# Altium schematic sheet Leningrad_orig.SchDoc
size A1
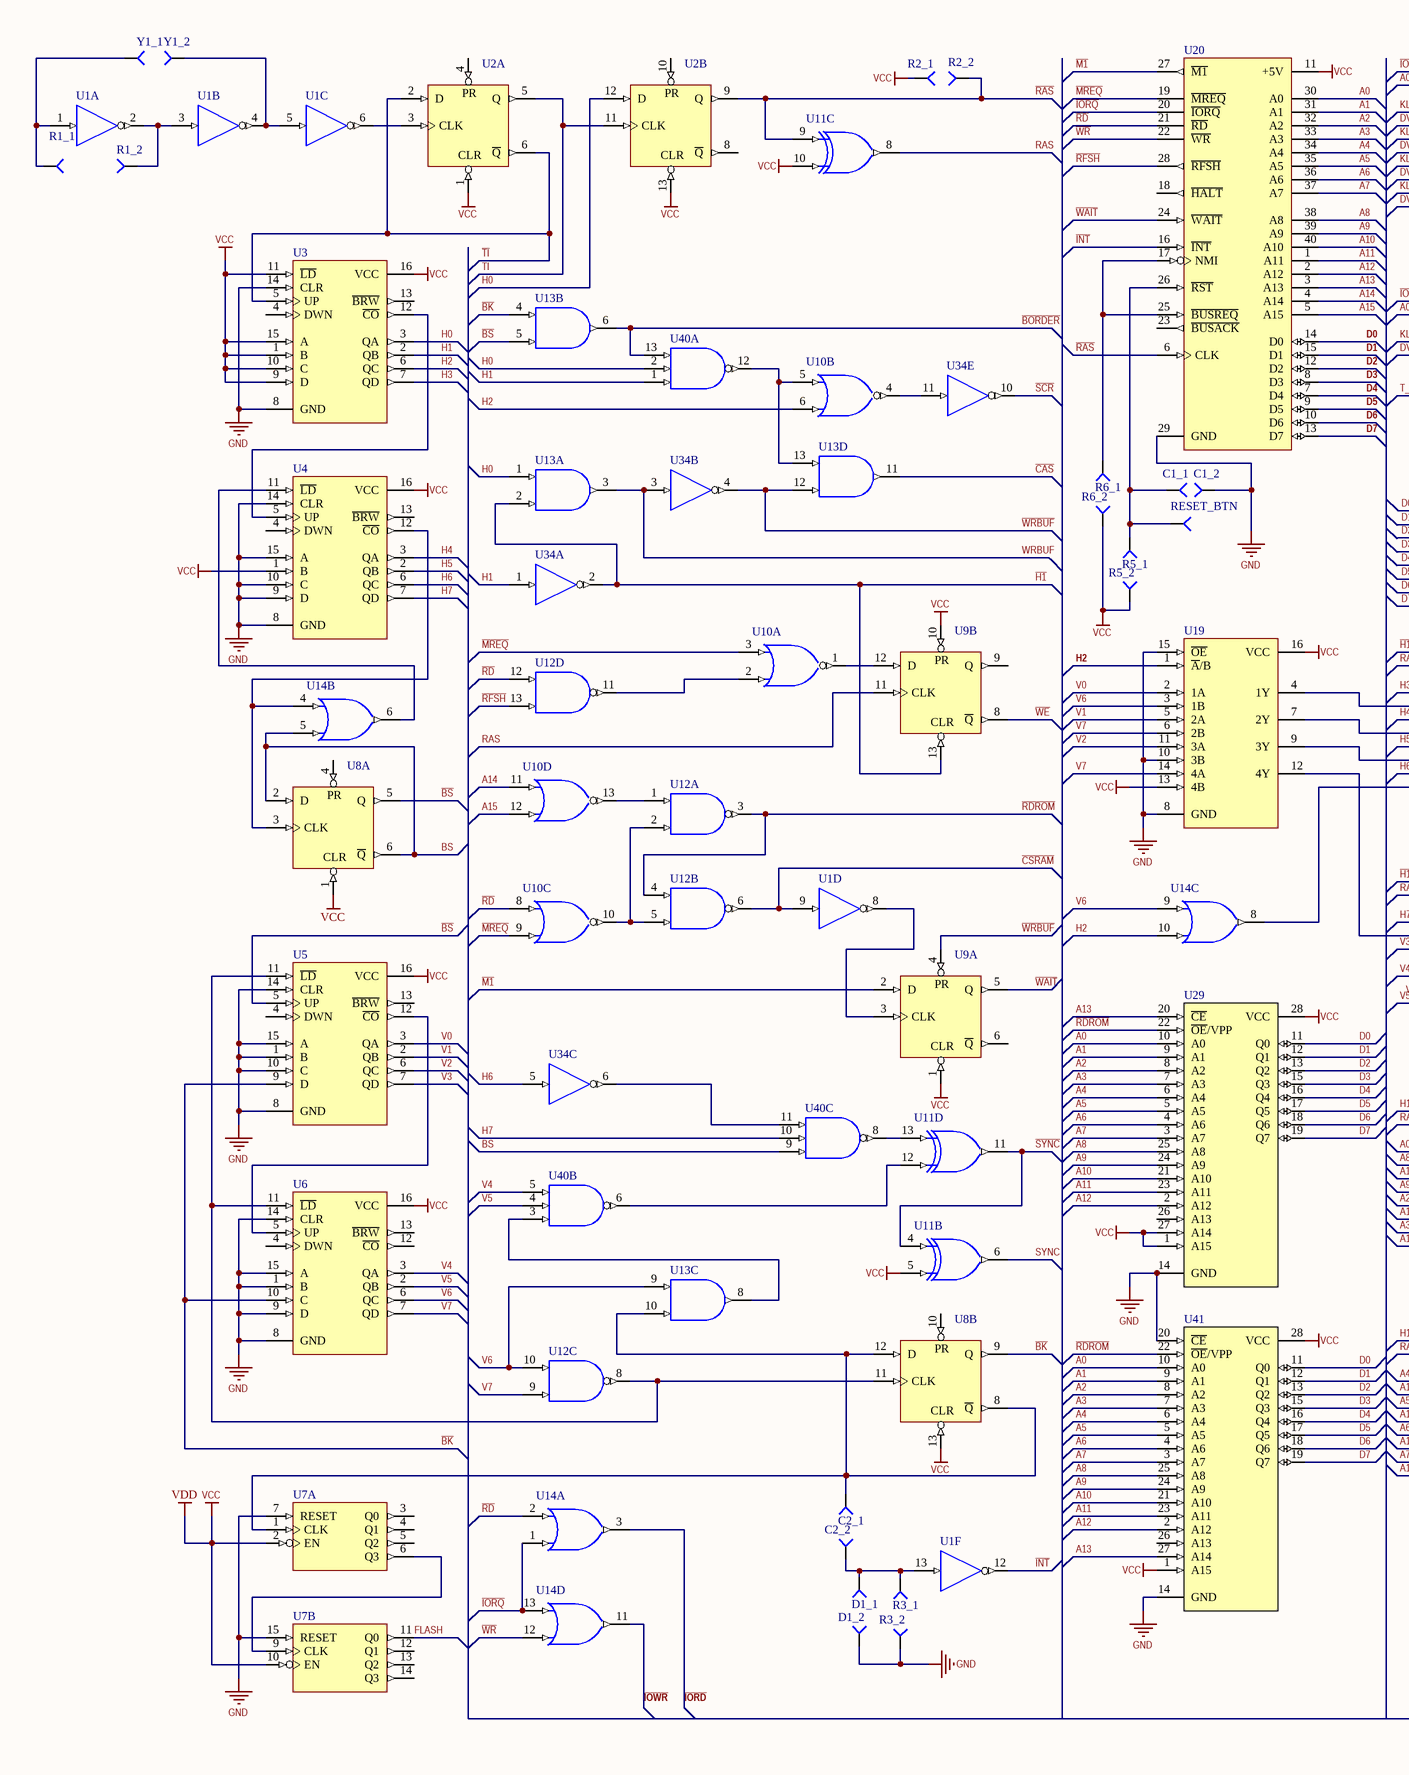
[diagram p0: Leningrad_orig.SchDoc, left]
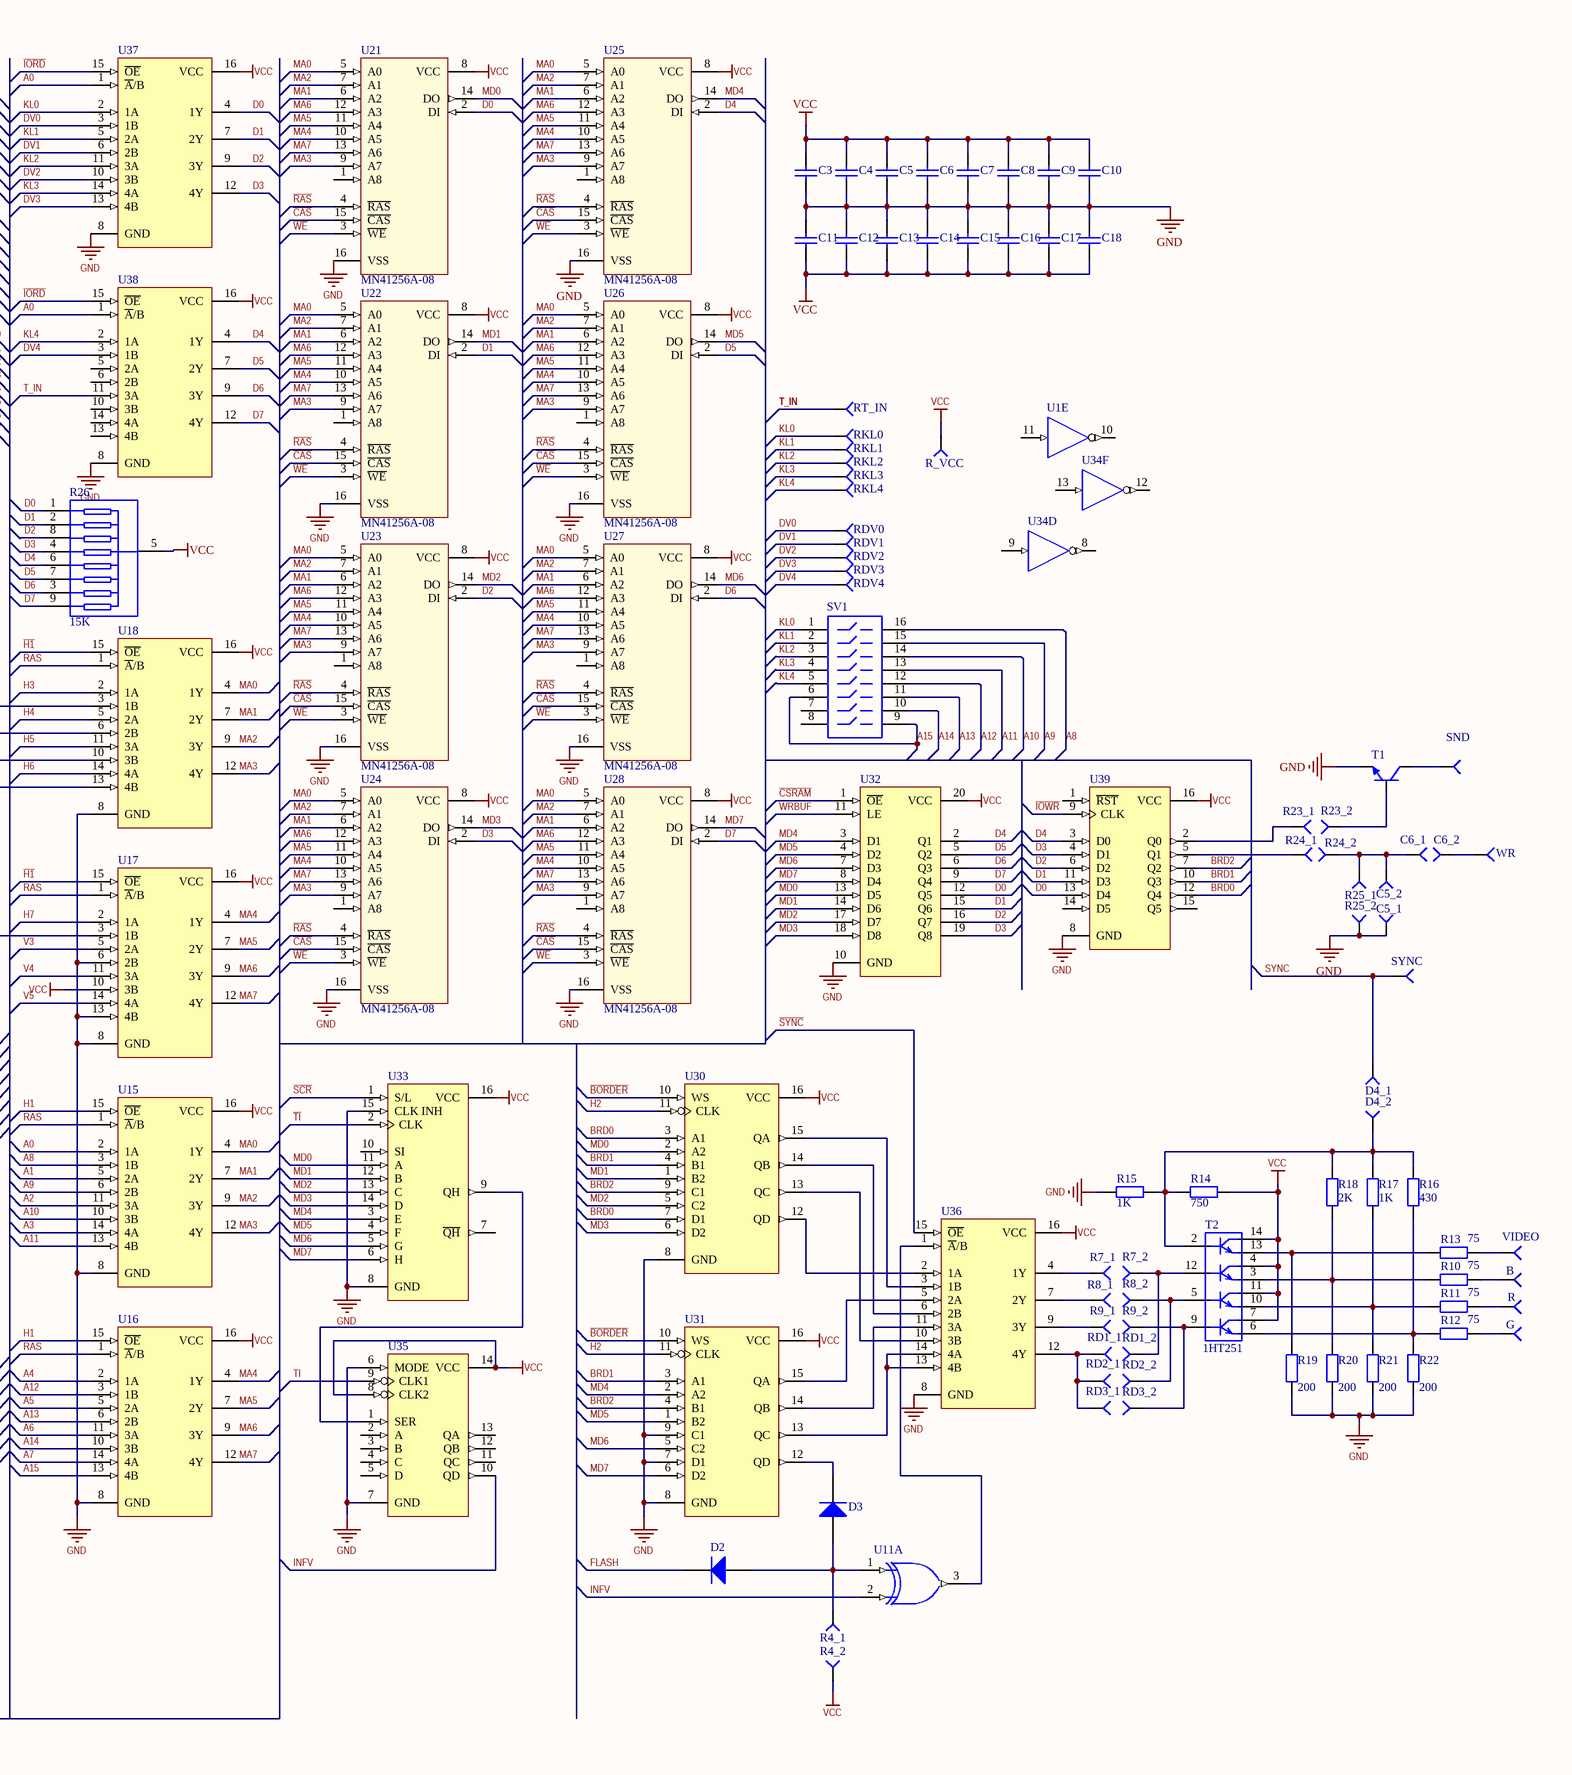
[diagram p1: Leningrad_orig.SchDoc, right]

## Parts
B  (no value)  [PIN1]
C1_1  (no value)  [PIN1]
C1_2  (no value)  [PIN1]
C2_1  (no value)  [PIN1]
C2_2  (no value)  [PIN1]
C3  (no value)  [RAD-0.3]
C4  (no value)  [RAD-0.3]
C5  (no value)  [RAD-0.3]
C5_1  (no value)  [PIN1]
C5_2  (no value)  [PIN1]
C6  (no value)  [RAD-0.3]
C6_1  (no value)  [PIN1]
C6_2  (no value)  [PIN1]
C7  (no value)  [RAD-0.3]
C8  (no value)  [RAD-0.3]
C9  (no value)  [RAD-0.3]
C10  (no value)  [RAD-0.3]
C11  (no value)  [RAD-0.3]
C12  (no value)  [RAD-0.3]
C13  (no value)  [RAD-0.3]
C14  (no value)  [RAD-0.3]
C15  (no value)  [RAD-0.3]
C16  (no value)  [RAD-0.3]
C17  (no value)  [RAD-0.3]
C18  (no value)  [RAD-0.3]
D1_1  (no value)  [PIN1]
D1_2  (no value)  [PIN1]
D2  (no value)  [DO-35A]
D3  (no value)  [DO-35A]
D4_1  Socket  [PIN1]  (value not drawn)
D4_2  Socket  [PIN1]  (value not drawn)
G  (no value)  [PIN1]
R  (no value)  [PIN1]
R1_1  (no value)  [PIN1]
R1_2  (no value)  [PIN1]
R2_1  (no value)  [PIN1]
R2_2  (no value)  [PIN1]
R3_1  (no value)  [PIN1]
R3_2  (no value)  [PIN1]
R4_1  (no value)  [PIN1]
R4_2  (no value)  [PIN1]
R5_1  (no value)  [PIN1]
R5_2  (no value)  [PIN1]
R6_1  (no value)  [PIN1]
R6_2  (no value)  [PIN1]
R7_1  (no value)  [PIN1]
R7_2  (no value)  [PIN1]
R8_1  (no value)  [PIN1]
R8_2  (no value)  [PIN1]
R9_1  (no value)  [PIN1]
R9_2  (no value)  [PIN1]
R10  value 75  [MLT]
R11  value 75  [MLT]
R12  value 75  [MLT]
R13  value 75  [MLT]
R14  value 750  [MLT]
R15  value 1K  [MLT]
R16  value 430  [MLT]
R17  value 1K  [MLT]
R18  value 2K  [MLT]
R19  value 200  [MLT]
R20  value 200  [MLT]
R21  value 200  [MLT]
R22  value 200  [MLT]
R23_1  (no value)  [PIN1]
R23_2  (no value)  [PIN1]
R24_1  (no value)  [PIN1]
R24_2  (no value)  [PIN1]
R25_1  (no value)  [PIN1]
R25_2  (no value)  [PIN1]
R26  value 15K  [LINE9]  (hidden comment: Res Pack8)
R_VCC  (no value)  [PIN1]
RD1_1  (no value)  [PIN1]
RD1_2  (no value)  [PIN1]
RD2_1  (no value)  [PIN1]
RD2_2  (no value)  [PIN1]
RD3_1  (no value)  [PIN1]
RD3_2  (no value)  [PIN1]
RDV0  (no value)  [PIN1]
RDV1  (no value)  [PIN1]
RDV2  (no value)  [PIN1]
RDV3  (no value)  [PIN1]
RDV4  (no value)  [PIN1]
RESET_BTN  (no value)  [PIN1]
RKL0  (no value)  [PIN1]
RKL1  (no value)  [PIN1]
RKL2  (no value)  [PIN1]
RKL3  (no value)  [PIN1]
RKL4  (no value)  [PIN1]
RT_IN  Socket  [PIN1]  (value not drawn)
SND  (no value)  [PIN1]
SV1  (no value)  [DIP-16-KEY]
SYNC  (no value)  [PIN1]
T1  KT315  [D35]  (value not drawn)
T2  1HT251  [CFP125P1450X730-14N]
U1  (no value)  [N014]  (parts A,B,C,D,E,F of 6)
U2  (no value)  [N014]  (parts A,B of 2)
U3  (no value)  [N016]
U4  (no value)  [N016]
U5  (no value)  [N016]
U6  (no value)  [N016]
U7  (no value)  [648-08]  (parts A,B of 2)
U8  (no value)  [N014]  (parts A,B of 2)
U9  (no value)  [N014]  (parts A,B of 2)
U10  (no value)  [N014]  (parts A,B,C,D of 4)
U11  (no value)  [N014]  (parts A,B,C,D of 4)
U12  (no value)  [N014]  (parts A,B,C,D of 4)
U13  (no value)  [N014]  (parts A,B,C,D of 4)
U14  (no value)  [N014]  (parts A,B,C,D of 4)
U15  (no value)  [N016]
U16  (no value)  [N016]
U17  (no value)  [N016]
U18  (no value)  [N016]
U19  (no value)  [N016]
U20  (no value)  [PDIP40]
U21  MN41256A-08  [DIP16]
U22  MN41256A-08  [DIP16]
U23  MN41256A-08  [DIP16]
U24  MN41256A-08  [DIP16]
U25  MN41256A-08  [DIP16]
U26  MN41256A-08  [DIP16]
U27  MN41256A-08  [DIP16]
U28  MN41256A-08  [DIP16]
U29  (no value)  [FDIP28W]
U30  (no value)  [N016D]
U31  (no value)  [N016D]
U32  (no value)  [N020]
U33  (no value)  [N016]
U34  (no value)  [N014]  (parts A,B,C,D,E,F of 6)
U35  (no value)  [N014]
U36  (no value)  [N016]
U37  (no value)  [N016]
U38  (no value)  [N016]
U39  (no value)  [N016]
U40  (no value)  [N014]  (parts A,B,C of 3)
U41  (no value)  [FDIP28W]
VIDEO  (no value)  [PIN1]
WR  (no value)  [PIN1]
Y1_1  Socket  [PIN1]  (value not drawn)
Y1_2  Socket  [PIN1]  (value not drawn)

## Nets
GND: C1_2.1 C3.1 C4.1 C5.1 C5_1.1 C6.1 C7.1 C8.1 C9.1 C10.1 C11.2 C12.2 C13.2 C14.2 C15.2 C16.2 C17.2 C18.2 D1_2.1 R3_2.1 R15.1 R19.1 R20.1 R21.1 R22.1 R25_2.1 T1.1(E) U1.7(GND) U2.7(GND) U3.8(GND) U3.14(CLR) U4.8(GND) U4.9(D) U4.10(C) U4.14(CLR) U4.15(A) U5.1(B) U5.8(GND) U5.10(C) U5.14(CLR) U5.15(A) U6.1(B) U6.8(GND) U6.9(D) U6.14(CLR) U6.15(A) U7.7(RESET) U7.8(GND) U7.15(RESET) U8.7(GND) U9.7(GND) U10.7(GND) U11.7(GND) U12.7(GND) U13.7(GND) U14.7(GND) U15.8(GND) U16.8(GND) U17.6(2B) U17.8(GND) U17.13(4B) U18.8(GND) U19.8(GND) U19.10(3B) U19.15(~{OE}) U20.29(GND) U21.16(VSS) U22.16(VSS) U23.16(VSS) U24.16(VSS) U25.16(VSS) U26.16(VSS) U27.16(VSS) U28.16(VSS) U29.14(GND) U30.8(GND) U31.7(D1) U31.8(GND) U31.9(C1) U32.10(GND) U33.8(GND) U33.15(CLK_INH) U34.7(GND) U35.6(MODE) U35.7(GND) U36.8(GND) U37.8(GND) U38.8(GND) U39.8(GND) U40.7(GND) U41.14(GND) U41.20(~{CE})
VCC: C3.2 C4.2 C5.2 C6.2 C7.2 C8.2 C9.2 C10.2 C11.1 C12.1 C13.1 C14.1 C15.1 C16.1 C17.1 C18.1 R2_1.1 R4_2.1 R5_2.1 R6_2.1 R14.2 R26.5 R_VCC.1 T2.4 T2.7 T2.11 T2.14 U1.14(VCC) U2.1(CLR) U2.13(CLR) U2.14(VCC) U3.1(B) U3.9(D) U3.10(C) U3.11(~{LD}) U3.15(A) U3.16(VCC) U4.1(B) U4.16(VCC) U5.16(VCC) U6.16(VCC) U7.2(EN) U7.10(EN) U7.16(VDD) U8.1(CLR) U8.13(CLR) U8.14(VCC) U9.1(CLR) U9.10(PR) U9.14(VCC) U10.14(VCC) U11.5(B) U11.10(B) U11.14(VCC) U12.14(VCC) U13.14(VCC) U14.14(VCC) U15.16(VCC) U16.16(VCC) U17.10(3B) U17.16(VCC) U18.16(VCC) U19.13(4B) U19.16(VCC) U20.11(+5V) U21.8(VCC) U22.8(VCC) U23.8(VCC) U24.8(VCC) U25.8(VCC) U26.8(VCC) U27.8(VCC) U28.8(VCC) U29.1(A15) U29.27(A14) U29.28(VCC) U30.16(VCC) U31.16(VCC) U32.20(VCC) U33.16(VCC) U34.14(VCC) U35.8(CLK2) U35.14(VCC) U36.16(VCC) U37.16(VCC) U38.16(VCC) U39.16(VCC) U40.14(VCC) U41.1(A15) U41.28(VCC)  [also labelled VDD]
A0: U15.2(1A) U20.30(A0) U29.10(A0) U37.1(~{A}/B) U38.1(~{A}/B) U41.10(A0)
A1: U15.5(2A) U20.31(A1) U29.9(A1) U41.9(A1)
A2: U15.11(3A) U20.32(A2) U29.8(A2) U41.8(A2)
A3: U15.14(4A) U20.33(A3) U29.7(A3) U41.7(A3)
A4: U16.2(1A) U20.34(A4) U29.6(A4) U41.6(A4)
A5: U16.5(2A) U20.35(A5) U29.5(A5) U41.5(A5)
A6: U16.11(3A) U20.36(A6) U29.4(A6) U41.4(A6)
A7: U16.14(4A) U20.37(A7) U29.3(A7) U41.3(A7)
A8: SV1.16 U15.3(1B) U20.38(A8) U29.25(A8) U41.25(A8)
A9: SV1.15 U15.6(2B) U20.39(A9) U29.24(A9) U41.24(A9)
A10: SV1.14 U15.10(3B) U20.40(A10) U29.21(A10) U41.21(A10)
A11: SV1.13 U15.13(4B) U20.1(A11) U29.23(A11) U41.23(A11)
A12: SV1.12 U16.3(1B) U20.2(A12) U29.2(A12) U41.2(A12)
A13: SV1.11 U16.6(2B) U20.3(A13) U29.20(~{CE}) U41.27(A14)
A14: SV1.10 U10.11(A) U16.10(3B) U20.4(A14)
A15: SV1.6 SV1.9 U10.12(B) U16.13(4B) U20.5(A15)
~{BK}: U5.9(D) U6.10(C) U8.9(Q) U13.4(A)
~{BORDER}: U13.6(Y) U30.10(WS) U31.10(WS) U40.13(C)
~{BS}: U5.5(UP) U8.5(Q) U13.5(B)
BRD0: U30.3(A1) U30.7(D1) U39.12(Q4)
BRD1: U30.4(B1) U31.3(A1) U39.10(Q3)
BRD2: U30.9(C1) U31.4(B1) U39.7(Q2)
BS: U8.2(D) U8.6(~{Q}) U14.5(B) U40.9(A)
~{CAS}: U13.11(Y) U21.15(~{CAS}) U22.15(~{CAS}) U23.15(~{CAS}) U24.15(~{CAS}) U25.15(~{CAS}) U26.15(~{CAS}) U27.15(~{CAS}) U28.15(~{CAS})
~{CSRAM}: U1.9(A) U12.6(Y) U32.1(~{OE})
D0: R26.1 U20.14(D0) U21.2(DI) U29.11(Q0) U32.12(Q5) U37.4(1Y) U39.13(D4) U41.11(Q0)
D1: R26.2 U20.15(D1) U22.2(DI) U29.12(Q1) U32.15(Q6) U37.7(2Y) U39.11(D3) U41.12(Q1)
D2: R26.8 U20.12(D2) U23.2(DI) U29.13(Q2) U32.16(Q7) U37.9(3Y) U39.6(D2) U41.13(Q2)
D3: R26.4 U20.8(D3) U24.2(DI) U29.15(Q3) U32.19(Q8) U37.12(4Y) U39.4(D1) U41.15(Q3)
D4: R26.6 U20.7(D4) U25.2(DI) U29.16(Q4) U32.2(Q1) U38.4(1Y) U39.3(D0) U41.16(Q4)
D5: R26.7 U20.9(D5) U26.2(DI) U29.17(Q5) U32.5(Q2) U38.7(2Y) U41.17(Q5)
D6: R26.3 U20.10(D6) U27.2(DI) U29.18(Q6) U32.6(Q3) U38.9(3Y) U41.18(Q6)
D7: R26.9 U20.13(D7) U28.2(DI) U29.19(Q7) U32.9(Q4) U38.12(4Y) U41.19(Q7)
DV0: RDV0.1 U37.3(1B)
DV1: RDV1.1 U37.6(2B)
DV2: RDV2.1 U37.10(3B)
DV3: RDV3.1 U37.13(4B)
DV4: RDV4.1 U38.3(1B)
FLASH: D2.2(K) U7.11(Q0)
H0: U2.12(D) U3.3(QA) U13.1(A) U40.2(B)
H1: U3.2(QB) U15.15(~{OE}) U16.15(~{OE}) U34.1(A) U40.1(A)
H2: U3.6(QC) U10.6(B) U14.10(B) U19.1(~{A}/B) U30.11(CLK) U31.11(CLK)
H3: U3.7(QD) U18.2(1A)
H4: U4.3(QA) U18.5(2A)
H5: U4.2(QB) U18.11(3A)
H6: U4.6(QC) U18.14(4A) U34.5(A)
H7: U4.7(QD) U17.2(1A) U40.10(B)
~{H1}: U9.13(CLR) U13.2(B) U17.15(~{OE}) U18.15(~{OE}) U34.2(Y)
~{INT}: U1.12(Y) U20.16(~{INT})
~{IORD}: U14.3(Y) U37.15(~{OE}) U38.15(~{OE})
~{IORQ}: U14.1(A) U14.13(B) U20.20(~{IORQ})
~{IOWR}: U14.11(Y) U39.9(CLK)
INFV: U11.2(B) U35.10(QD)
KL0: RKL0.1 SV1.1 U37.2(1A)
KL1: RKL1.1 SV1.2 U37.5(2A)
KL2: RKL2.1 SV1.3 U37.11(3A)
KL3: RKL3.1 SV1.4 U37.14(4A)
KL4: RKL4.1 SV1.5 U38.2(1A)
~{M1}: U9.2(D) U20.27(~{M1})
~{MREQ}: U10.3(B) U10.9(B) U20.19(~{MREQ})
MA0: U15.4(1Y) U18.4(1Y) U21.5(A0) U22.5(A0) U23.5(A0) U24.5(A0) U25.5(A0) U26.5(A0) U27.5(A0) U28.5(A0)
MA1: U15.7(2Y) U18.7(2Y) U21.6(A2) U22.6(A2) U23.6(A2) U24.6(A2) U25.6(A2) U26.6(A2) U27.6(A2) U28.6(A2)
MA2: U15.9(3Y) U18.9(3Y) U21.7(A1) U22.7(A1) U23.7(A1) U24.7(A1) U25.7(A1) U26.7(A1) U27.7(A1) U28.7(A1)
MA3: U15.12(4Y) U18.12(4Y) U21.9(A7) U22.9(A7) U23.9(A7) U24.9(A7) U25.9(A7) U26.9(A7) U27.9(A7) U28.9(A7)
MA4: U16.4(1Y) U17.4(1Y) U21.10(A5) U22.10(A5) U23.10(A5) U24.10(A5) U25.10(A5) U26.10(A5) U27.10(A5) U28.10(A5)
MA5: U16.7(2Y) U17.7(2Y) U21.11(A4) U22.11(A4) U23.11(A4) U24.11(A4) U25.11(A4) U26.11(A4) U27.11(A4) U28.11(A4)
MA6: U16.9(3Y) U17.9(3Y) U21.12(A3) U22.12(A3) U23.12(A3) U24.12(A3) U25.12(A3) U26.12(A3) U27.12(A3) U28.12(A3)
MA7: U16.12(4Y) U17.12(4Y) U21.13(A6) U22.13(A6) U23.13(A6) U24.13(A6) U25.13(A6) U26.13(A6) U27.13(A6) U28.13(A6)
MD0: U21.14(DO) U30.2(A2) U32.13(D5) U33.11(A)
MD1: U22.14(DO) U30.1(B2) U32.14(D6) U33.12(B)
MD2: U23.14(DO) U30.5(C2) U32.17(D7) U33.13(C)
MD3: U24.14(DO) U30.6(D2) U32.18(D8) U33.14(D)
MD4: U25.14(DO) U31.2(A2) U32.3(D1) U33.3(E)
MD5: U26.14(DO) U31.1(B2) U32.4(D2) U33.4(F)
MD6: U27.14(DO) U31.5(C2) U32.7(D3) U33.5(G)
MD7: U28.14(DO) U31.6(D2) U32.8(D4) U33.6(H)
~{RAS}: R2_2.1 U2.9(Q) U11.9(A) U20.6(CLK) U21.4(~{RAS}) U22.4(~{RAS}) U23.4(~{RAS}) U24.4(~{RAS}) U25.4(~{RAS}) U26.4(~{RAS}) U27.4(~{RAS}) U28.4(~{RAS})
~{RD}: U10.8(A) U12.12(A) U14.2(B) U20.21(~{RD})
~{RDROM}: U12.3(Y) U12.4(A) U29.22(~{OE}/VPP) U41.22(~{OE}/VPP)
~{RFSH}: U12.13(B) U20.28(~{RFSH})
RAS: U9.11(CLK) U11.8(Y) U15.1(~{A}/B) U16.1(~{A}/B) U17.1(~{A}/B) U18.1(~{A}/B)
~{SCR}: U33.1(S/L) U34.10(Y)
~{SYNC}: U11.4(A) U11.11(Y) U36.15(~{OE})
SYNC: D4_1.1 SYNC.1 U11.6(Y)
~{TI}: U2.2(D) U2.6(~{Q}) U3.5(UP) U33.2(CLK)
T_IN: RT_IN.1 U38.11(3A)
TI: U2.5(Q) U2.11(CLK) U35.9(CLK1)
V0: U5.3(QA) U19.2(1A)
V1: U5.2(QB) U19.5(2A)
V2: U5.6(QC) U19.11(3A)
V3: U5.7(QD) U17.5(2A)
V4: U6.3(QA) U17.11(3A) U40.5(C)
V5: U6.2(QB) U17.14(4A) U40.4(B)
V6: U6.6(QC) U12.10(B) U13.9(A) U14.9(A) U19.3(1B)
V7: U6.7(QD) U12.9(A) U19.6(2B) U19.14(4A)
~{WAIT}: U9.5(Q) U20.24(~{WAIT})
~{WE}: U9.8(~{Q}) U21.3(~{WE}) U22.3(~{WE}) U23.3(~{WE}) U24.3(~{WE}) U25.3(~{WE}) U26.3(~{WE}) U27.3(~{WE}) U28.3(~{WE})
~{WR}: U14.12(A) U20.22(~{WR})
~{WRBUF}: U9.4(PR) U13.12(A) U34.4(Y)
WRBUF: U13.3(Y) U32.11(LE) U34.3(A)
NetB_1: B.1 R10.2
NetC1_1_1: C1_1.1 R5_1.1 RESET_BTN.1 U20.26(~{RST})
NetC2_1_1: C2_1.1 U7.1(CLK) U8.8(~{Q}) U8.12(D) U13.10(B)
NetC2_2_1: C2_2.1 D1_1.1 R3_1.1 U1.13(A)
NetC5_2_1: C5_2.1 C6_1.1 R24_2.1 R25_1.1
NetC6_2_1: C6_2.1 WR.1
NetD2_1: D2.1(A) D3.1(A) R4_1.1 U11.1(A)
NetD3_2: D3.2(K) U31.12(QD)
NetD4_2_1: D4_2.1 R14.1 R15.2 R16.2 R17.2 R18.2 T2.2
NetG_1: G.1 R12.2
NetR1_1_1: R1_1.1 U1.1(A) Y1_1.1
NetR1_2_1: R1_2.1 U1.2(Y) U1.3(A)
NetR6_1_1: R6_1.1 U20.17(NMI) U20.25(~{BUSREQ})
NetR7_1_1: R7_1.1 U36.4(1Y)
NetR7_2_1: R7_2.1 RD1_2.1 T2.12
NetR8_1_1: R8_1.1 U36.7(2Y)
NetR8_2_1: R8_2.1 RD2_2.1 T2.5
NetR9_1_1: R9_1.1 U36.9(3Y)
NetR9_2_1: R9_2.1 RD3_2.1 T2.9
NetR10_1: R10.1 R18.1 R20.2 T2.3
NetR11_1: R11.1 R17.1 R21.2 T2.10
NetR12_1: R12.1 R16.1 R22.2 T2.6
NetR13_1: R13.1 R19.2 T2.13
NetR13_2: R13.2 VIDEO.1
NetR23_1_1: R23_1.1 U39.2(Q0)
NetR23_2_1: R23_2.1 T1.3(B)
NetR24_1_1: R24_1.1 U39.5(Q1)
NetR_1: R.1 R11.2
NetRD1_1_1: RD1_1.1 RD2_1.1 RD3_1.1 U36.12(4Y)
NetSND_1: SND.1 T1.2(C)
NetU1_4: U1.4(Y) U1.5(A) Y1_2.1
NetU1_6: U1.6(Y) U2.3(CLK)
NetU1_8: U1.8(Y) U9.3(CLK)
NetU3_12: U3.12(~{CO}) U4.5(UP)
NetU4_11: U4.11(~{LD}) U14.6(Y)
NetU4_12: U4.12(~{CO}) U8.3(CLK) U14.4(A)
NetU5_11: U5.11(~{LD}) U6.11(~{LD}) U8.11(CLK) U12.8(Y)
NetU5_12: U5.12(~{CO}) U6.5(UP)
NetU7_6: U7.6(Q3) U7.9(CLK)
NetU9_12: U9.12(D) U10.1(Y)
NetU10_2: U10.2(A) U12.11(Y)
NetU10_4: U10.4(Y) U34.11(A)
NetU10_5: U10.5(A) U13.13(B) U40.12(Y)
NetU10_10: U10.10(Y) U12.2(B) U12.5(B)
NetU10_13: U10.13(Y) U12.1(A)
NetU11_3: U11.3(Y) U36.1(~{A}/B)
NetU11_12: U11.12(A) U40.6(Y)
NetU11_13: U11.13(B) U40.8(Y)
NetU13_8: U13.8(Y) U40.3(A)
NetU14_8: U14.8(Y) U18.13(4B)
NetU17_3: U17.3(1B) U19.12(4Y)
NetU18_3: U18.3(1B) U19.4(1Y)
NetU18_6: U18.6(2B) U19.7(2Y)
NetU18_10: U18.10(3B) U19.9(3Y)
NetU30_12: U30.12(QD) U36.2(1A)
NetU30_13: U30.13(QC) U36.10(3B)
NetU30_14: U30.14(QB) U36.6(2B)
NetU30_15: U30.15(QA) U36.3(1B)
NetU31_13: U31.13(QC) U36.13(4B) U36.14(4A)
NetU31_14: U31.14(QB) U36.11(3A)
NetU31_15: U31.15(QA) U36.5(2A)
NetU33_9: U33.9(QH) U35.1(SER)
NetU34_6: U34.6(Y) U40.11(C)

Not connected (* = marked no-connect by the designer): SV1 7 8; U1 10(Y) 11(A); U2 4(PR) 8(~{Q}) 10(PR); U3 4(DWN) 13(~{BRW}); U4 4(DWN) 13(~{BRW}); U5 4(DWN) 13(~{BRW}); U6 4(DWN) 12(~{CO}) 13(~{BRW}); U7 3(Q0) 4(Q1) 5(Q2) 12(Q1) 13(Q2) 14(Q3); U8 4(PR) 10(PR); U9 6(~{Q}) 9(Q); U20 18(~{HALT}) 23(~{BUSACK}); U21 1(A8); U22 1(A8); U23 1(A8); U24 1(A8); U25 1(A8); U26 1(A8); U27 1(A8); U28 1(A8); U29 26(A13); U33 7(~{QH}) 10(SI); U34 8(Y) 9(A) 12(Y) 13(A); U35 2(A) 3(B) 4(C) 5(D) 11(QC) 12(QB) 13(QA); U38 5(2A) 6(2B) 10(3B) 13(4B) 14(4A); U39 1(~{RST}) 14(D5) 15(Q5); U41 26(A13)

## Library data of the parts
B C1_1 C1_2 C2_1 C2_2 C5_1 C5_2 C6_1 C6_2 D1_1 D1_2 G R R1_1 R1_2 R2_1 R2_2 R3_1 R3_2 R4_1 R4_2 R5_1 R5_2 R6_1 R6_2 R7_1 R7_2 R8_1 R8_2 R9_1 R9_2 R23_1 R23_2 R24_1 R24_2 R25_1 R25_2 R_VCC RD1_1 RD1_2 RD2_1 RD2_2 RD3_1 RD3_2 RDV0-RDV4 RESET_BTN RKL0-RKL4 SND SYNC VIDEO WR = Socket: LatestRevisionDate: 17-Jul-2002; LatestRevisionNote: Re-released for DXP Platform.; Publisher: Altium Limited
C3-C18 = Cap: Capacitor; Value: 100pF; Published: 8-Jun-2000; LatestRevisionDate: 17-Jul-2002; LatestRevisionNote: Re-released for DXP Platform.; PackageReference: RAD-0.3; Publisher: Altium Limited; PackageDescription: Radial Cap, Thru-Hole; 2 Leads; 0.3 in Pin Spacing
D2 D3 = Diode 1N4149: Computer Diode; Published: 8-Jun-2000; LatestRevisionDate: 17-Jul-2002; LatestRevisionNote: Re-released for DXP Platform.; DatasheetVersion: 1989; PackageReference: DO-35A; Publisher: Altium Limited; PackageDescription: Diode, Axial; Body 4.6 x 1.9 mm (LxDia. max), Lead Dia. 0.53 mm (max); Code_JEDEC: DO-204-AH; ComponentLink1Description: Manufacturer Link; ComponentLink1URL: http://www.national.com/; PackageVersion: 1989
R10-R22 = Res2: Resistor; Published: 8-Jun-2000; LatestRevisionDate: 17-Jul-2002; LatestRevisionNote: Re-released for DXP Platform.; PackageReference: AXIAL-0.4; Publisher: Altium Limited; PackageDescription: Axial Device, Thru-Hole; 2 Leads; 0.4 in Pin Spacing
R26 = Res Pack8: pin to pad: 1>2 2>1 3>6 4>8 6>9 8>4 9>3
SV1 = SW-DIP8: 4009 Series DIP Switch, Raised actuator; Published: 24-Mar-1999; LatestRevisionDate: 17-Dec-2003; LatestRevisionNote: PCB Footprint replaced.; PackageReference: DIP-16-KEY; Publisher: Altium Limited; PackageDescription: DIP; 16 Leads; Row Spacing 7.62 mm; Pitch 2.54 mm; ComponentLink1Description: Manufacturer Link; ComponentLink1URL: http://www.oupiin.com/prodindx.html#Headers
T1 = KT315: NPN General Purpose Amplifier; Published: 8-Jun-2000; LatestRevisionDate: 15-Jan-2003; LatestRevisionNote: PCB Footprint 'BCY-W3/D4.7' replaced; DatasheetVersion: 1997; PackageVersion: Sep-1998; PackageReference: TO-92A; Publisher: Altium Limited; PackageDescription: TO, Flat Index; 3 In-Line, Axial Leads; Body Dia. 4.5mm; Leads 0.51 x 0.48 mm (max); ComponentLink1Description: Manufacturer Link; ComponentLink1URL: http://www.fairchildsemi.com/; ComponentLink2Description: Datasheet; ComponentLink2URL: http://www.fairchildsemi.com/ds/2N%2F2N3904.pdf
U1 U34 = SN74HC04N: Hex Inverter; Published: 8-Jun-2000; LatestRevisionDate: 04-Mar-2005; LatestRevisionNote: Stylized 3D Model Added.; DatasheetVersion: May-1997; PackageVersion: Oct-1995; PackageReference: N014; Publisher: Altium Limited; PackageDescription: DIP; 14 Leads; Row Spacing 7.62 mm; Pitch 2.54 mm; ComponentLink1Description: Manufacturer Link; ComponentLink1URL: http://www.ti.com/; ComponentLink2Description: Datasheet; ComponentLink2URL: http://www-s.ti.com/sc/ds/sn74hc04.pdf
U2 U8 U9 = SN74HC74N: Dual D-Type Positive-Edge-Triggered Flip-Flop with Clear and Preset; Published: 8-Jun-2000; LatestRevisionDate: 04-Mar-2005; LatestRevisionNote: Stylized 3D Model Added.; DatasheetVersion: May-1997; PackageVersion: Oct-1995; PackageReference: N014; Publisher: Altium Limited; PackageDescription: DIP; 14 Leads; Row Spacing 7.62 mm; Pitch 2.54 mm; ComponentLink1Description: Manufacturer Link; ComponentLink1URL: http://www.ti.com/; ComponentLink2Description: Datasheet; ComponentLink2URL: http://www-s.ti.com/sc/ds/sn74hc74.pdf
U3-U6 = SN74HC193N: 4-Bit Synchronous Up/Down Counter (Dual Clock with Clear); Published: 8-Jun-2000; LatestRevisionDate: 04-Mar-2005; LatestRevisionNote: Stylized 3D Model Added.; DatasheetVersion: May-1997; PackageVersion: Oct-1995; PackageReference: N016; Publisher: Altium Limited; PackageDescription: DIP; 16 Leads; Row Spacing 7.62 mm; Pitch 2.54 mm; Code_JEDEC: MS-001-BB; ComponentLink1Description: Manufacturer Link; ComponentLink1URL: http://www.ti.com/; ComponentLink2Description: Datasheet; ComponentLink2URL: http://www-s.ti.com/sc/ds/sn74hc193.pdf
U7 = MC14520BCP: Dual Binary Up Counter; Published: 15-Apr-2002; DatasheetVersion: 1995; PackageVersion: Apr-2000; PackageReference: 648-08; Publisher: Altium Limited; PackageDescription: DIP; 16 Leads; Row Spacing 7.62 mm; Pitch 2.54 mm; Code_JEDEC: MS-001-BB; ComponentLink1Description: Manufacturer Link; ComponentLink1URL: http://www.onsemi.com/; ComponentLink2Description: Datasheet; ComponentLink2URL: http://www.onsemi.com/pub/Collateral/MC14518B-D.PDF
U10 = SN74HC02N: Quadruple 2-Input Positive-NOR Gate; Published: 8-Jun-2000; LatestRevisionDate: 04-Mar-2005; LatestRevisionNote: Stylized 3D Model Added.; DatasheetVersion: May-1997; PackageVersion: Oct-1995; PackageReference: N014; Publisher: Altium Limited; PackageDescription: DIP; 14 Leads; Row Spacing 7.62 mm; Pitch 2.54 mm; ComponentLink1Description: Manufacturer Link; ComponentLink1URL: http://www.ti.com/; ComponentLink2Description: Datasheet; ComponentLink2URL: http://www-s.ti.com/sc/ds/sn74hc02.pdf
U11 = SN74HC86N: Quadruple 2-Input Exclusive-OR Gate; Published: 8-Jun-2000; LatestRevisionDate: 04-Mar-2005; LatestRevisionNote: Stylized 3D Model Added.; DatasheetVersion: Aug-1999; PackageVersion: Oct-1995; PackageReference: N014; Publisher: Altium Limited; PackageDescription: DIP; 14 Leads; Row Spacing 7.62 mm; Pitch 2.54 mm; ComponentLink1Description: Manufacturer Link; ComponentLink1URL: http://www.ti.com/; ComponentLink2Description: Datasheet; ComponentLink2URL: http://www-s.ti.com/sc/ds/SN54HC86.pdf
U12 = SN74HC00N: Quadruple 2-Input Positive-NAND Gate; Published: 8-Jun-2000; LatestRevisionDate: 04-Mar-2005; LatestRevisionNote: Stylized 3D Model Added.; DatasheetVersion: May-1997; PackageVersion: Oct-1995; PackageReference: N014; Publisher: Altium Limited; PackageDescription: DIP; 14 Leads; Row Spacing 7.62 mm; Pitch 2.54 mm; ComponentLink1Description: Manufacturer Link; ComponentLink1URL: http://www.ti.com/; ComponentLink2Description: Datasheet; ComponentLink2URL: http://www-s.ti.com/sc/ds/sn74hc00.pdf
U13 = SN74HC08N: Quadruple 2-Input Positive-AND Gate; Published: 8-Jun-2000; LatestRevisionDate: 04-Mar-2005; LatestRevisionNote: Stylized 3D Model Added.; DatasheetVersion: May-1997; PackageVersion: Oct-1995; PackageReference: N014; Publisher: Altium Limited; PackageDescription: DIP; 14 Leads; Row Spacing 7.62 mm; Pitch 2.54 mm; ComponentLink1Description: Manufacturer Link; ComponentLink1URL: http://www.ti.com/; ComponentLink2Description: Datasheet; ComponentLink2URL: http://www-s.ti.com/sc/ds/SN74HC08.pdf
U14 = SN74HC32N: Quadruple 2-Input Positive-OR Gate; Published: 8-Jun-2000; LatestRevisionDate: 04-Mar-2005; LatestRevisionNote: Stylized 3D Model Added.; DatasheetVersion: May-1997; PackageVersion: Oct-1995; PackageReference: N014; Publisher: Altium Limited; PackageDescription: DIP; 14 Leads; Row Spacing 7.62 mm; Pitch 2.54 mm; ComponentLink1Description: Manufacturer Link; ComponentLink1URL: http://www.ti.com/; ComponentLink2Description: Datasheet; ComponentLink2URL: http://www-s.ti.com/sc/ds/sn74hc32.pdf
U15-U19 U36-U38 = SN74HC257N: Quadruple 2-Line to 1-Line Data Selector/Multiplexer with 3-State Outputs; Published: 8-Jun-2000; LatestRevisionDate: 04-Mar-2005; LatestRevisionNote: Stylized 3D Model Added.; DatasheetVersion: Jun-1989; PackageVersion: Oct-1995; PackageReference: N016; Publisher: Altium Limited; PackageDescription: DIP; 16 Leads; Row Spacing 7.62 mm; Pitch 2.54 mm; Code_JEDEC: MS-001-BB; ComponentLink1Description: Manufacturer Link; ComponentLink1URL: http://www.ti.com/; ComponentLink2Description: Datasheet; ComponentLink2URL: http://www-s.ti.com/sc/ds/sn74hc257.pdf
U20 = Z84C0010PEC: CMOS 8-Bit Microprocessor; Published: 15-Apr-2002; LatestRevisionDate: 04-Mar-2005; LatestRevisionNote: Stylized 3D Model Added.; DatasheetVersion: Jan-1989; PackageVersion: Jun-1999; PackageReference: PDIP40; Publisher: Altium Limited; PackageDescription: DIP; 40 Leads; Row Spacing 15.24 mm; Pitch 2.54 mm; ComponentLink1Description: Manufacturer Link; ComponentLink1URL: http://www.zilog.com/; ComponentLink2Description: Datasheet; ComponentLink2URL: http://www.zilog.com/docs/z80/um0081.pdf
U29 U41 = M27C512-90XF6: 512 Kbit (64Kb x 8) UV EPROM and OTP EPROM; Published: 24-Aug-2001; LatestRevisionDate: 06-Jun-2005; LatestRevisionNote: Stylized 3D Model Added.; DatasheetVersion: Nov-1998; PackageReference: FDIP28W; Publisher: Altium Limited; PackageDescription: Ceramic Frit-seal DIP, Window; 28 Leads; Row Spacing 15.24 mm; Pitch 2.54 mm; ComponentLink1Description: Manufacturer Link; ComponentLink1URL: http://www.st.com/; ComponentLink2Description: Datasheet; ComponentLink2URL: http://www.st.com/stonline/products/literature/ds/2387/m27c512.pdf
U30 U31 = SN74HC298N: Quadruple 2-Input Multiplexer with Storage; Published: 8-Jun-2000; LatestRevisionDate: 04-Mar-2005; LatestRevisionNote: Stylized 3D Model Added.; DatasheetVersion: Jun-1989; PackageVersion: Oct-1995; PackageReference: N016D; Publisher: Altium Limited; PackageDescription: DIP; 16 Leads; Row Spacing 7.62 mm; Pitch 2.54 mm; Code_JEDEC: MS-001-BB; ComponentLink1Description: Manufacturer Link; ComponentLink1URL: http://www.ti.com/
U32 = SN74HC373N: Octal Transparent D-Type Latches with 3-State Outputs; Published: 8-Jun-2000; LatestRevisionDate: 04-Mar-2005; LatestRevisionNote: Stylized 3D Model Added.; DatasheetVersion: May-1997; PackageVersion: Oct-1995; PackageReference: N020; Publisher: Altium Limited; PackageDescription: DIP; 20 Leads; Row Spacing 7.62 mm; Pitch 2.54 mm; ComponentLink1Description: Manufacturer Link; ComponentLink1URL: http://www.ti.com/; ComponentLink2Description: Datasheet; ComponentLink2URL: http://www-s.ti.com/sc/ds/sn54hc373.pdf
U33 = SN74HC165N: 8-Bit Parallel-Load Shift Register; Published: 8-Jun-2000; LatestRevisionDate: 04-Mar-2005; LatestRevisionNote: Stylized 3D Model Added.; DatasheetVersion: May-1997; PackageVersion: Oct-1995; PackageReference: N016; Publisher: Altium Limited; PackageDescription: DIP; 16 Leads; Row Spacing 7.62 mm; Pitch 2.54 mm; Code_JEDEC: MS-001-BB; ComponentLink1Description: Manufacturer Link; ComponentLink1URL: http://www.ti.com/; ComponentLink2Description: Datasheet; ComponentLink2URL: http://www-s.ti.com/sc/ds/sn74hc165.pdf
U35 = SN74LS95BN: 4-Bit Parallel-Access Shift Register; ComponentAvailability: Obsolete; Published: 8-Jun-2000; LatestRevisionDate: 04-Mar-2005; LatestRevisionNote: Stylized 3D Model Added.; DatasheetVersion: Mar-1988; PackageVersion: Oct-1995; PackageReference: N014; Publisher: Altium Limited; PackageDescription: DIP; 14 Leads; Row Spacing 7.62 mm; Pitch 2.54 mm; ComponentLink1Description: Manufacturer Link; ComponentLink1URL: http://www.ti.com/; ComponentLink2Description: Datasheet; ComponentLink2URL: http://www-s.ti.com/sc/ds/sn5495a.pdf
U39 = SN74HC174N: Hex D-Type Flip-Flop with Clear; Published: 8-Jun-2000; LatestRevisionDate: 04-Mar-2005; LatestRevisionNote: Stylized 3D Model Added.; DatasheetVersion: May-1997; PackageVersion: Oct-1995; PackageReference: N016; Publisher: Altium Limited; PackageDescription: DIP; 16 Leads; Row Spacing 7.62 mm; Pitch 2.54 mm; Code_JEDEC: MS-001-BB; ComponentLink1Description: Manufacturer Link; ComponentLink1URL: http://www.ti.com/; ComponentLink2Description: Datasheet; ComponentLink2URL: http://www-s.ti.com/sc/ds/sn74hc174.pdf
U40 = SN74HC10N: Triple 3-Input Positive-NAND Gate; Published: 8-Jun-2000; LatestRevisionDate: 04-Mar-2005; LatestRevisionNote: Stylized 3D Model Added.; DatasheetVersion: May-1997; PackageVersion: Oct-1995; PackageReference: N014; Publisher: Altium Limited; PackageDescription: DIP; 14 Leads; Row Spacing 7.62 mm; Pitch 2.54 mm; ComponentLink1Description: Manufacturer Link; ComponentLink1URL: http://www.ti.com/; ComponentLink2Description: Datasheet; ComponentLink2URL: http://www-s.ti.com/sc/ds/sn74hc10.pdf
D4_1 D4_2 RT_IN Y1_1 Y1_2 = Socket: LatestRevisionDate: 17-Jul-2002; LatestRevisionNote: Re-released for DXP Platform.; Publisher: Altium Limited